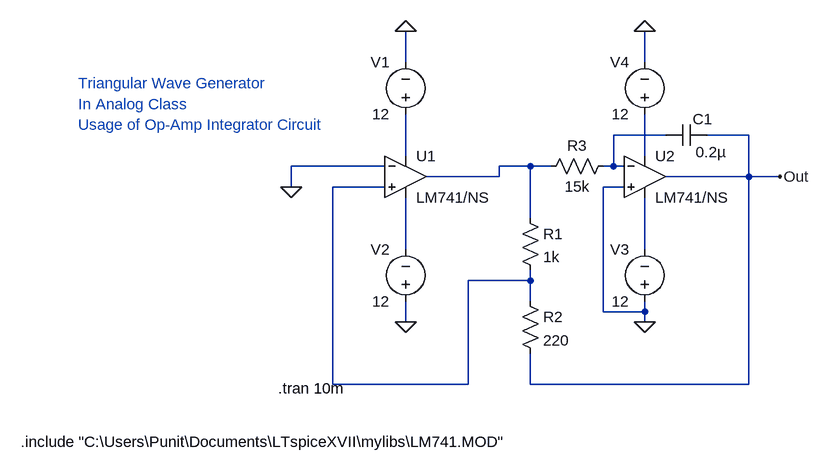
[diagram p0: schematic triangular_wave_generator.asc]
triangular_wave_generator.asc, the LTspice schematic file:
Version 4
SHEET 1 880 680
WIRE 32 -16 32 -64
WIRE 400 -16 400 -64
WIRE 432 96 352 96
WIRE 560 96 496 96
WIRE 32 128 32 64
WIRE 400 128 400 64
WIRE 0 144 -144 144
WIRE 224 144 176 144
WIRE 256 144 224 144
WIRE 352 144 352 96
WIRE 352 144 336 144
WIRE 368 144 352 144
WIRE 176 160 176 144
WIRE 176 160 64 160
WIRE 560 160 560 96
WIRE 560 160 432 160
WIRE 608 160 560 160
WIRE -144 176 -144 144
WIRE 0 176 -80 176
WIRE 368 176 336 176
WIRE 224 224 224 144
WIRE 32 272 32 192
WIRE 400 272 400 192
WIRE 224 320 224 304
WIRE 224 320 128 320
WIRE 224 352 224 320
WIRE 336 368 336 176
WIRE 400 368 400 352
WIRE 400 368 336 368
WIRE 32 384 32 352
WIRE 400 384 400 368
WIRE -80 480 -80 176
WIRE 128 480 128 320
WIRE 128 480 -80 480
WIRE 224 480 224 432
WIRE 560 480 560 160
WIRE 560 480 224 480
FLAG -144 176 0
FLAG 32 384 0
FLAG 400 -64 0
FLAG 400 384 0
FLAG 608 160 Out
FLAG 32 -64 0
SYMBOL OpAmps\\opamp2 32 96 R0
SYMATTR InstName U1
SYMATTR Value LM741/NS
SYMBOL OpAmps\\opamp2 400 96 R0
SYMATTR InstName U2
SYMATTR Value LM741/NS
SYMBOL res 208 208 R0
SYMATTR InstName R1
SYMATTR Value 1k
SYMBOL res 208 336 R0
SYMATTR InstName R2
SYMATTR Value 220
SYMBOL res 352 128 R90
WINDOW 0 0 56 VBottom 2
WINDOW 3 32 56 VTop 2
SYMATTR InstName R3
SYMATTR Value 15k
SYMBOL cap 496 80 R90
WINDOW 0 7 7 VBottom 2
WINDOW 3 27 -6 VTop 2
SYMATTR InstName C1
SYMATTR Value 0.2µ
SYMBOL voltage 32 80 R180
WINDOW 0 24 96 Left 2
WINDOW 3 24 16 Left 2
WINDOW 123 0 0 Left 0
WINDOW 39 0 0 Left 0
SYMATTR InstName V1
SYMATTR Value 12
SYMBOL voltage 32 368 R180
WINDOW 0 24 96 Left 2
WINDOW 3 24 16 Left 2
WINDOW 123 0 0 Left 0
WINDOW 39 0 0 Left 0
SYMATTR InstName V2
SYMATTR Value 12
SYMBOL voltage 400 368 R180
WINDOW 0 24 96 Left 2
WINDOW 3 24 16 Left 2
WINDOW 123 0 0 Left 0
WINDOW 39 0 0 Left 0
SYMATTR InstName V3
SYMATTR Value 12
SYMBOL voltage 400 80 R180
WINDOW 0 24 96 Left 2
WINDOW 3 24 16 Left 2
WINDOW 123 0 0 Left 0
WINDOW 39 0 0 Left 0
SYMATTR InstName V4
SYMATTR Value 12
TEXT -164 486 Left 2 !.tran 10m
TEXT -560 568 Left 2 !.include "C:\\Users\\Punit\\Documents\\LTspiceXVII\\mylibs\\LM741.MOD"
TEXT -472 16 Left 2 ;Triangular Wave Generator
TEXT -472 48 Left 2 ;In Analog Class
TEXT -472 80 Left 2 ;Usage of Op-Amp Integrator Circuit

The netlist it stands for:
* triangular_wave_generator.asc
XU1 N005 0 N002 N006 N004 LM741/NS  ; pins In+ In- V+ V- OUT
XU2 0 N001 N003 N007 Out LM741/NS  ; pins In+ In- V+ V- OUT
R1 N004 N005 1k
R2 N005 Out 220
R3 N001 N004 15k
C1 Out N001 0.2µ
V1 N002 0 12
V2 0 N006 12
V3 0 N007 12
V4 N003 0 12
.tran 10m
.include "C:\Users\Punit\Documents\LTspiceXVII\mylibs\LM741.MOD"
* Triangular Wave Generator
* In Analog Class
* Usage of Op-Amp Integrator Circuit
.backanno
.end